# Altium project SVPXGR740_3U.PrjPcb (part 7 of 8)

## Sheet USB_JTAG.SchDoc
size A3
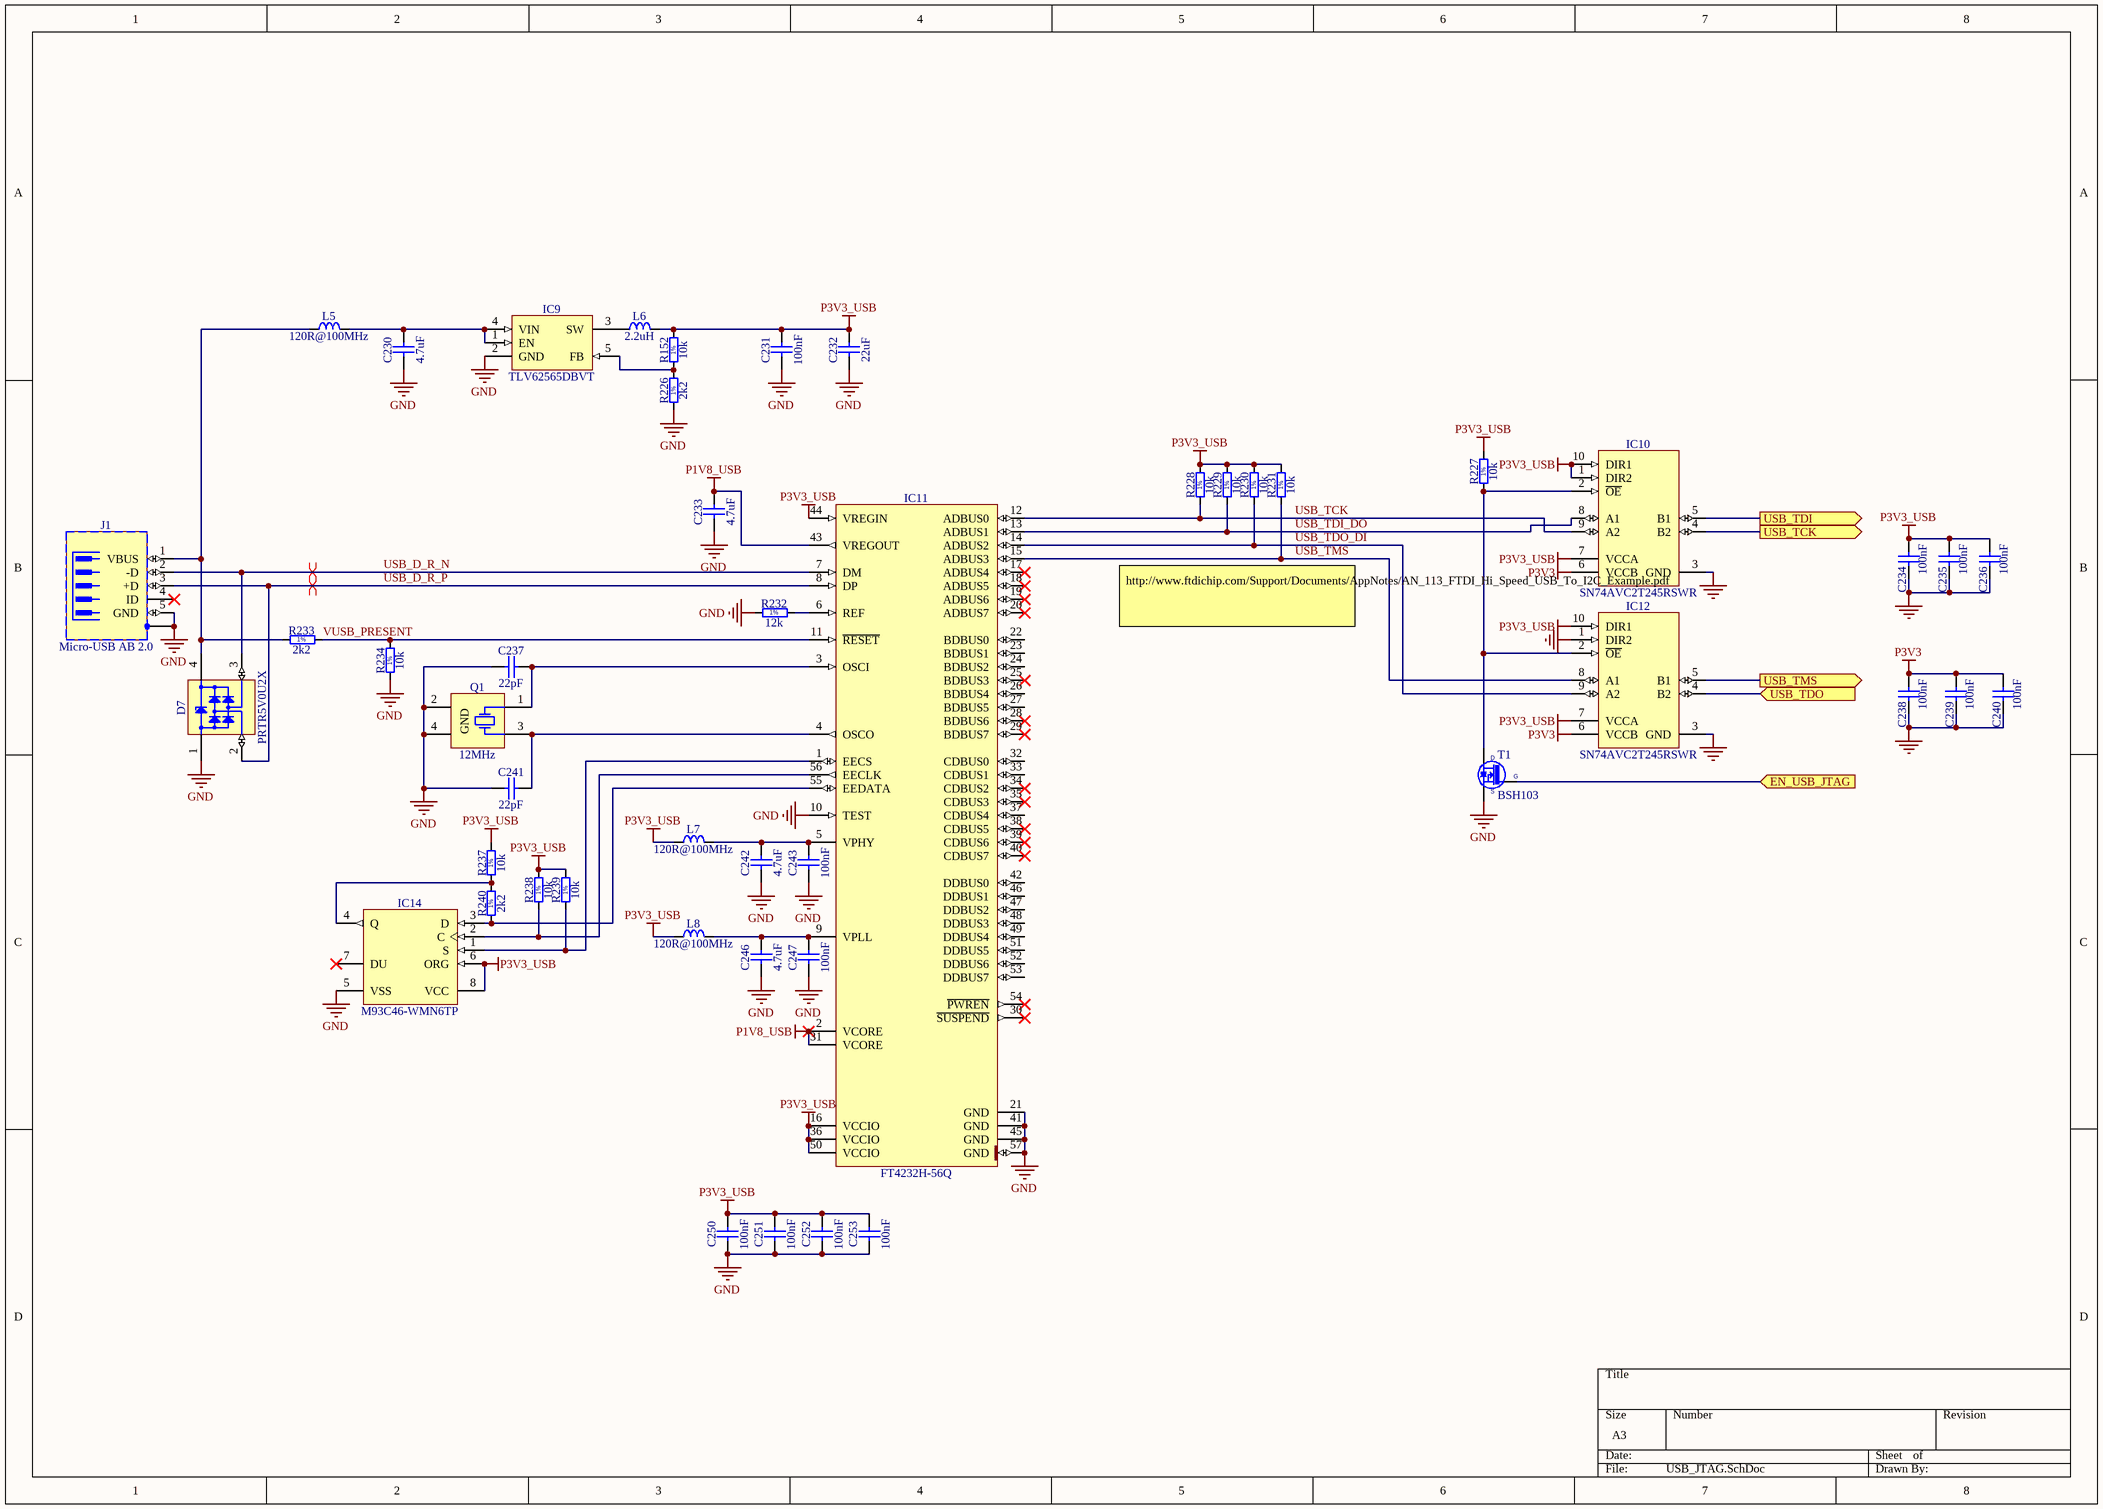
[diagram p21: USB_JTAG.SchDoc]

### Parts
C230  4.7uF  [CAPC2012X135N]
C231  100nF  [CAPC0603X33N]
C232  22uF  [CAPC1709X100N]
C233  4.7uF  [CAPC2012X135N]
C234  100nF  [CAPC0603X33N]
C235  100nF  [CAPC0603X33N]
C236  100nF  [CAPC0603X33N]
C237  22pF  [CAPC1005X55N]
C238  100nF  [CAPC0603X33N]
C239  100nF  [CAPC0603X33N]
C240  100nF  [CAPC0603X33N]
C241  22pF  [CAPC1005X55N]
C242  4.7uF  [CAPC2012X135N]
C243  100nF  [CAPC0603X33N]
C246  4.7uF  [CAPC2012X135N]
C247  100nF  [CAPC0603X33N]
C250  100nF  [CAPC0603X33N]
C251  100nF  [CAPC0603X33N]
C252  100nF  [CAPC0603X33N]
C253  100nF  [CAPC0603X33N]
D7  PRTR5V0U2X  [SOT190P230X110-4N]
IC9  TLV62565DBVT  [SOT95P280X145-5N]
IC10  SN74AVC2T245RSWR  [QFN40P140X180X55-10N]
IC11  FT4232H-56Q  [QFN50P800X800X100-57N-S620]
IC12  SN74AVC2T245RSWR  [QFN40P140X180X55-10N]
IC14  M93C46-WMN6TP  [SOIC127P600X175-8N]
J1  Micro-USB AB 2.0  [HIROSE_ZX62RD-AB-5P8]
L5  120R@100MHz  [INDC1608X65N]
L6  2.2uH  [IND_WURTH_WE-PMCI_0806LR]
L7  120R@100MHz  [INDC1608X65N]
L8  120R@100MHz  [INDC1608X65N]
Q1  12MHz  [XTAL_TXC_7M]
R152  10k  [RESC1005X40N]
R226  2k2  [RESC1005X40N]
R227  10k  [RESC1005X40N]
R228  10k  [RESC1005X40N]
R229  10k  [RESC1005X40N]
R230  10k  [RESC1005X40N]
R231  10k  [RESC1005X40N]
R232  12k  [RESC1005X40N]
R233  2k2  [RESC1005X40N]
R234  10k  [RESC1005X40N]
R237  10k  [RESC1005X40N]
R238  10k  [RESC1005X40N]
R239  10k  [RESC1005X40N]
R240  2k2  [RESC1005X40N]
T1  BSH103  [SOT95P230X110-3N]

### Ports
EN_USB_JTAG (in), USB_TCK (out), USB_TDI (out), USB_TDO (in), USB_TMS (out)

### Nets
GND: C230.1 C231.1 C232.1 C233.1 C234.1 C235.1 C236.1 C237.1 C238.1 C239.1 C240.1 C241.1 C242.1 C243.1 C246.1 C247.1 C250.1 C251.1 C252.1 C253.1 D7.1(GND) IC9.2(GND) IC10.3(GND) IC11.10(TEST) IC11.21(GND) IC11.41(GND) IC11.45(GND) IC11.57(GND) IC12.1(DIR2) IC12.3(GND) IC14.5(VSS) J1.5(GND) J1.6(SH) Q1.2(GND) Q1.4(GND) R226.1 R232.1 R234.1 T1.2(S)
P1V8_USB: C233.2 IC11.2(VCORE) IC11.31(VCORE) IC11.43(VREGOUT)
P3V3: C238.2 C239.2 C240.2 IC10.6(VCCB) IC12.6(VCCB)  [project net 3.3V]
P3V3_USB: C231.2 C232.2 C234.2 C235.2 C236.2 C250.2 C251.2 C252.2 C253.2 IC10.1(DIR2) IC10.7(VCCA) IC10.10(DIR1) IC11.16(VCCIO) IC11.36(VCCIO) IC11.44(VREGIN) IC11.50(VCCIO) IC12.7(VCCA) IC12.10(DIR1) IC14.6(ORG) IC14.8(VCC) L6.2 L7.1 L8.1 R152.2 R227.2 R228.2 R229.2 R230.2 R231.2 R237.2 R238.2 R239.2
CPU_TCK: IC10.4(B2) ; port USB_TCK
CPU_TDI: IC10.5(B1) ; port USB_TDI
CPU_TDO: IC12.4(B2) ; port USB_TDO
CPU_TMS: IC12.5(B1) ; port USB_TMS
GND_DET: T1.1(G) ; port EN_USB_JTAG
USB_D_R_N: D7.3(I/O2) IC11.7(DM) J1.2(-D)
USB_D_R_P: D7.2(I/O1) IC11.8(DP) J1.3(+D)
USB_TCK: IC10.9(A2) IC11.12(ADBUS0) R228.1
USB_TDI_DO: IC10.8(A1) IC11.13(ADBUS1) R229.1
USB_TDO_DI: IC11.14(ADBUS2) IC12.9(A2) R230.1
USB_TMS: IC11.15(ADBUS3) IC12.8(A1) R231.1
VUSB_PRESENT: IC11.11(~{RESET}) R233.2 R234.2
NetC230_2: C230.2 IC9.1(EN) IC9.4(VIN) L5.2
NetC237_2: C237.2 IC11.3(OSCI) Q1.1(X)
NetC241_2: C241.2 IC11.4(OSCO) Q1.3(X)
NetC242_2: C242.2 C243.2 IC11.5(VPHY) L7.2
NetC246_2: C246.2 C247.2 IC11.9(VPLL) L8.2
NetD7_4: D7.4(VCC) J1.1(VBUS) L5.1 R233.1
NetIC9_3: IC9.3(SW) L6.1
NetIC9_5: IC9.5(FB) R152.1 R226.2
NetIC10_2: IC10.2(~{OE}) IC12.2(~{OE}) R227.1 T1.3(D)
NetIC11_1: IC11.1(EECS) IC14.1(S) R239.1
NetIC11_6: IC11.6(REF) R232.2
NetIC11_55: IC11.55(EEDATA) IC14.3(D) R240.2
NetIC11_56: IC11.56(EECLK) IC14.2(C) R238.1
NetIC14_4: IC14.4(Q) R237.1 R240.1

Not connected (* = marked no-connect by the designer): IC11 17(ADBUS4)* 18(ADBUS5)* 19(ADBUS6)* 20(ADBUS7)* 22(BDBUS0) 23(BDBUS1) 24(BDBUS2) 25(BDBUS3)* 26(BDBUS4) 27(BDBUS5) 28(BDBUS6)* 29(BDBUS7)* 30(~{SUSPEND})* 32(CDBUS0) 33(CDBUS1) 34(CDBUS2)* 35(CDBUS3)* 37(CDBUS4) 38(CDBUS5)* 39(CDBUS6)* 40(CDBUS7)* 42(DDBUS0) 46(DDBUS1) 47(DDBUS2) 48(DDBUS3) 49(DDBUS4) 51(DDBUS5) 52(DDBUS6) 53(DDBUS7) 54(~{PWREN})*; IC14 7(DU)*; J1 4(ID)*

### Layout directives
differential pair: USB_D_R_N, USB_D_R_P

### Notes on the sheet
- http://www.ftdichip.com/Support/Documents/AppNotes/AN_113_FTDI_Hi_Speed_USB_To_I2C_Example.pdf
- (in symbol R0402_2K2_1%_0.0625W_100PPM) 1%
- (in symbol R0402_10K_1%_0.0625W_100PPM) 1%
- (in symbol R0402_12K_1%_0.0625W_100PPM) 1%

### Library data of the parts
C230 C233 C242 C246 = CC0805_4.7UF_10V_10%_X5R: Non-polarised capacitor; Part Description: SMD Multilayer Chip Ceramic Capacitor; Manufacturer: GENERIC; Manufacturer1 Part Number: 222224013672; Voltage: 10V; TC: X5R; Tolerance: ±10%; Part Number: CC0805_4.7UF_10V_10%_X5R; Component Kind: Standard; Component Type: Standard; Pin Count: 2; Value: 4.7uF; Status: Preferred; Manufacturer Part Number: CC0805_4.7UF_10V_10%_X5R; Case: 0805; Mounted: Yes; Socket: No; SMD: Yes; Sense: No; Manufacturer1 Example: PHYCOMP; Manufacturer1 ComponentHeight: 1.45mm; HelpURL: \\cern.ch\dfs\Applications\Altium\Datasheets\CC0805_X5R_PHYCOMP_HC.pdf; Author: CERN DEM JLC; CreateDate: 03.12.2007; LatestRevisionDate: 03.12.2007
C231 C234-C236 C238-C240 C243 C247 C250-C253 = CC0201_100NF_6.3V_10%_X5R: Non-polarised capacitor; Part Description: SMD Multilayer Chip Ceramic Capacitor; Manufacturer: GENERIC; Manufacturer1 Part Number: 02016D104KAT2A; Voltage: 6.3V; TC: X5R; Tolerance: ±10%; Part Number: CC0201_100NF_6.3V_10%_X5R; Component Kind: Standard; Component Type: Standard; Pin Count: 2; Value: 100nF; Status: Not Recommended; Manufacturer Part Number: CC0201_100NF_6.3V_10%_X5R; Case: 0201; Mounted: Yes; Socket: No; SMD: Yes; Sense: No; Manufacturer1 Example: AVX; Manufacturer1 ComponentHeight: 0.33mm; HelpURL: \\cern.ch\dfs\Applications\Altium\Datasheets\CC0201_X5R_AVX.pdf; Author: CERN DEM JLC
  C231 C243 C247 C250-C253: CreateDate: 03.12.2007; LatestRevisionDate: 03.12.2007
  C234-C236 C238-C240: CreateDate: 2007-12-03; LatestRevisionDate: 2007-12-03
C232 = CC0603_22UF_6.3V_20%_X5R: Non-polarised capacitor; Part Description: SMD Multilayer Chip Ceramic Capacitor; Manufacturer: GENERIC; Manufacturer1 Part Number: C1608X5R0J226M080AC; Voltage: 6.3V; TC: X5R; Tolerance: ±20%; Part Number: CC0603_22UF_6.3V_20%_X5R; Component Kind: Standard; Component Type: Standard; Pin Count: 2; Value: 22uF; Status: None; Manufacturer Part Number: CC0603_22UF_6.3V_20%_X5R; Case: 0603; Mounted: Yes; Socket: No; SMD: Yes; Sense: No; Manufacturer1 Example: TDK; Manufacturer1 ComponentHeight: 1mm; HelpURL: \\cern.ch\dfs\Applications\Altium\Datasheets\CC0603_X5R_TDK_C.pdf; Author: CERN DEM JLC; CreateDate: 16.12.2013; LatestRevisionDate: 13.09.2016; ClassName: Artix
C237 C241 = CC0402_22PF_50V_5%_C0G: Non-polarised capacitor; Part Description: SMD Multilayer Chip Ceramic Capacitor; Manufacturer: GENERIC; Manufacturer1 Part Number: C0402C220J5GACTU; Voltage: 50V; TC: C0G/NP0; Tolerance: ±5%; Part Number: CC0402_22PF_50V_5%_C0G; Component Kind: Standard; Component Type: Standard; Pin Count: 2; Value: 22pF; Status: Preferred; Manufacturer Part Number: CC0402_22PF_50V_5%_C0G; Case: 0402; Mounted: Yes; Socket: No; SMD: Yes; Sense: No; Manufacturer1 Example: KEMET; Manufacturer1 ComponentHeight: 0.55mm; HelpURL: \\cern.ch\dfs\Applications\Altium\Datasheets\CC0805_C0G_KEMET_(Commercial Grade).pdf; Author: CERN DEM JLC; CreateDate: 03.12.2007; LatestRevisionDate: 03.12.2007
D7 = PRTR5V0U2X: Ultra Low Capacitance Double Rail-to-Rail ESD Protection Diode; Part Description: Ultra Low Capacitance (1pF) Double Rail-to-Rail ESD Protection Diode (8kV); Manufacturer: NXP SEMICONDUCTORS; Voltage: 5.5V; PressFit: No; Bonding: No; Part Number: PRTR5V0U2X; Component Kind: Standard; Component Type: Standard; Device: PRTR5V0U2X; PackageDescription: SOT143B, SOT, 1.90mm Pitch; 4 Pin, 1.30mm W X 2.90mm L X 1.10mm H body, IPC Medium Density; Manufacturer Part Number: PRTR5V0U2X; Pin Count: 4; Case: SOT143B; Mounted: Yes; Socket: No; SMD: Yes; Sense: No; ComponentHeight: 1.1mm; HelpURL: \\cern.ch\dfs\Applications\Altium\Datasheets\PRTR5V0U2X.pdf; Author: CERN DEM JLC; CreateDate: 22.03.2011; LatestRevisionDate: 22.03.2011
IC9 = TLV62565DBVT: 1.5A High Efficiency Step-Down Converter, Adjustable Output Voltage; Manufacturer: TEXAS INSTRUMENTS; PressFit: No; Bonding: No; Part Number: TLV62565DBVT; Component Kind: Standard; Component Type: Standard; Device: TLV62565DBVT; PackageDescription: SOT, 0.95mm Pitch; 5 Pin, 1.60mm W X 2.90mm L X 1.45mm H Body, IPC Medium Density; Part Description: 1.5A High Efficiency Step-Down Converter, Adjustable Output Voltage; Manufacturer Part Number: TLV62565DBVT; Pin Count: 5; Case: SOT23-5; Mounted: Yes; Socket: No; SMD: Yes; Sense: No; ComponentHeight: 1.45mm; HelpURL: \\cern.ch\dfs\Applications\Altium\Datasheets\TLV62565DBVT.pdf; Author: CERN DEM JMW; CreateDate: 29.08.2016; LatestRevisionDate: 29.08.2016
IC10 IC12 = SN74AVC2T245RSWR: Dual-Bit Dual-Supply Bus Transceiver With Configurable Voltage Translation and 3-State Outputs; Manufacturer: TEXAS INSTRUMENTS; PressFit: No; Bonding: No; Part Number: SN74AVC2T245RSWR; Component Kind: Standard; Component Type: Standard; Device: SN74AVC2T245RSWR; PackageDescription: QFN, 0.40mm Pitch, Rect.;10 Pin, 1.80mm L X 1.40mm W X 0.55mm H Body, IPC Medium Density; Status: Not Recommended; Part Description: Dual-Bit Dual-Supply Bus Transceiver With Configurable Voltage Translation and 3-State Outputs; Manufacturer Part Number: SN74AVC2T245RSWR; Pin Count: 10; Case: QFN10; Mounted: Yes; Socket: No; SMD: Yes; Sense: No; ComponentHeight: 0.55mm; Author: CERN DEM JLC; HelpURL: \\cern.ch\dfs\Applications\Altium\Datasheets\SN74AVC2T245RSWR.pdf; CreateDate: 07.07.2014; LatestRevisionDate: 30.03.2017
IC11 = FT4232H-56Q: Quad High Speed USB to Multipurpose UART/MPSSE IC; Manufacturer: FUTURE TECHNOLOGY DEVICES INTERNATIONAL (FTDI); PressFit: No; Bonding: No; Part Number: FT4232H-56Q; Component Kind: Standard; Component Type: Standard; Device: FT4232H-56Q; PackageDescription: QFN, 0.50mm Pitch, Square; 56 Pin, 8.00mm L X 8.00mm W X 1.00mm H body (6.1mm X 6.1mm Thermal tab), IPC Medium Density; Part Description: Quad High Speed USB to Multipurpose UART/MPSSE IC; Manufacturer Part Number: FT4232H-56Q; Pin Count: 57; Case: QFN56; Mounted: Yes; Socket: No; SMD: Yes; Sense: No; ComponentHeight: 1mm; Author: CERN DEM JLC; HelpURL: \\cern.ch\dfs\Applications\Altium\Datasheets\FT4232H-56Q.pdf; CreateDate: 11.10.2016; LatestRevisionDate: 11.10.2016
IC14 = M93C46-WMN6TP: 2.5 to 5.5 V, 1Kb (128x8) Serial Microwire Bus EEPROM; Part Description: 1Kbit (128 x 8 bit or 64 x 16 bit) MICROWIRE® Serial Access EEPROM; Manufacturer: ST MICROELECTRONICS; PressFit: No; Bonding: No; Part Number: M93C46-WMN6TP; Component Kind: Standard; Component Type: Standard; Device: M93C46-WMN6TP; PackageDescription: SOIC 8, Pitch 1.27mm - Body 4x5mm, IPC Medium Density; Manufacturer Part Number: M93C46-WMN6TP; Pin Count: 8; Case: SOIC8; Mounted: Yes; Socket: No; SMD: Yes; Sense: No; ComponentHeight: 1.75mm; HelpURL: \\cern.ch\dfs\Applications\Altium\Datasheets\M93C46-WMN6TP.pdf; Author: CERN DEM JLC; CreateDate: 15.11.2012; LatestRevisionDate: 15.11.2012
J1 = HIROSE_ZX62RD-AB-5P8: 5 Pin + 1 Shield USB Receptacle; Part Description: Micro-USB 2.0 Right Angle, SMD Type AB - Reverse (Top mount), Shell Through Hole; Manufacturer: HIROSE (HRS); PressFit: No; Part Number: HIROSE_ZX62RD-AB-5P8; Component Kind: Standard; Component Type: Standard; Pin Count: 7; Family: Micro-USB AB 2.0; Mounted: Yes; Socket: No; SMD: Yes; Sense: No; Status: None; Manufacturer Part Number: ZX62RD-AB-5P8; ComponentHeight: 2.35mm; HelpURL: \\cern.ch\dfs\Applications\Altium\Datasheets\HIROSE_ZX62RD-AB-5P8.pdf; ComponentLink1URL: \\cern.ch\dfs\Applications\Altium\Datasheets\HIROSE_ZX62RD-AB-5P8_Package-Drawing.pdf; ComponentLink1Description: Package-Drawing; Author: CERN DEM JLC; CreateDate: 29.10.2014; LatestRevisionDate: 29.10.2014; ClassName: Connectors
L5 L7 L8 = IND0603_MURATA_BLM18SG121TN1D: Inductor; Part Description: SMD EMIFIL Suppression Chip Ferrite Bead; Manufacturer: MURATA; Power: 3A; Resistance: 0.025R; Tolerance: ±25%; Part Number: IND0603_MURATA_BLM18SG121TN1D; Component Kind: Standard; Component Type: Standard; Pin Count: 2; Value: 120R@100MHz; Status: None; Manufacturer Part Number: BLM18SG121TN1D; Case: 0603; Mounted: Yes; Socket: No; SMD: Yes; Sense: No; ComponentHeight: 0.65mm; HelpURL: \\cern.ch\dfs\Applications\Altium\Datasheets\IND0603_MURATA_BLM18S.pdf; Author: CERN DEM JLC; CreateDate: 23.07.2014; LatestRevisionDate: 23.07.2014
L6 = IND_2.2UH_20%_WURTH_WE-PMCI_74479276222C: Inductor; Part Description: SMD Power Molded Chip  Inductor (WE-PMCI Series); Manufacturer: WURTH ELEKTRONIK; Power: 1.1A; Resistance: 0.112R; Tolerance: ±20%; Part Number: IND_2.2UH_20%_WURTH_WE-PMCI_74479276222C; Component Kind: Standard; Component Type: Standard; Pin Count: 2; Value: 2.2uH; Status: None; Manufacturer Part Number: 74479276222C; Case: 0806; Mounted: Yes; Socket: No; SMD: Yes; Sense: No; ComponentHeight: 1mm; HelpURL: \\cern.ch\dfs\Applications\Altium\Datasheets\IND_WURTH_WE-PMCI_74479276222C.pdf; Author: CERN DEM JLC; CreateDate: 20.10.2016; LatestRevisionDate: 20.10.2016
Q1 = XTAL_12MHZ_TXC_7M-12.000MAAJ-T: Crystal 4 pins 1=XTAL Control 2=GND3=XTAL 4=GND; Part Description: ±30ppm 18pF -20°C to +70°C  4 Pins, 3.2x2.5X0.8mm, SMD Sealing Crystal, 7M Series; Manufacturer: TXC CORPORATION; PressFit: No; Bonding: No; Part Number: XTAL_12MHZ_TXC_7M-12.000MAAJ-T; Component Kind: Standard; Component Type: Standard; PackageDescription: 4 Pins, 2.5x3.2mm, SMD Sealing Crystal, 7M Serie; Value: 12MHz; Manufacturer Part Number: 7M-12.000MAAJ-T; Pin Count: 4; Mounted: Yes; Socket: No; SMD: Yes; Sense: No; ComponentHeight: 0.8mm; HelpURL: \\cern.ch\dfs\Applications\Altium\Datasheets\XTAL_TXC_7M.pdf; Author: CERN DEM JLC; CreateDate: 19.06.2012; LatestRevisionDate: 19.06.2012
R152 R227-R231 R234 R237-R239 = R0402_10K_1%_0.0625W_100PPM: as R177 on sheet Power; Part Number: R0402_10K_1%_0.0625W_100PPM; Component Kind: Standard; Component Type: Standard; Pin Count: 2; Value: 10k; Status: Not Recommended; Power: 0.0625W; Tolerance: ±1%; Manufacturer Part Number: R0402_10K_1%_0.0625W_100PPM; Case: 0402; Mounted: Yes; Sense: No; Socket: No; SMD: Yes; Manufacturer1 Example: YAGEO PHYCOMP; Manufacturer1 ComponentHeight: 0.4mm; HelpURL: \\cern.ch\dfs\Applications\Altium\Datasheets\R0402_Phycomp_RC0402.pdf; Author: CERN DEM JLC; CreateDate: 03.12.2007; LatestRevisionDate: 17.10.2012
R226 R233 R240 = R0402_2K2_1%_0.0625W_100PPM: Resistor - 1%; Part Description: General Purpose Thick Film Chip Resistor; Manufacturer: GENERIC; Manufacturer1 Part Number: 232270672202L; TC: ±100ppm/°C; PressFit: No; Part Number: R0402_2K2_1%_0.0625W_100PPM; Component Kind: Standard; Component Type: Standard; Pin Count: 2; Value: 2k2; Status: Not Recommended; Power: 0.0625W; Tolerance: ±1%; Manufacturer Part Number: R0402_2K2_1%_0.0625W_100PPM; Case: 0402; Mounted: Yes; Sense: No; Socket: No; SMD: Yes; Manufacturer1 Example: YAGEO PHYCOMP; Manufacturer1 ComponentHeight: 0.4mm; HelpURL: \\cern.ch\dfs\Applications\Altium\Datasheets\R0402_Phycomp_RC0402.pdf; Author: CERN DEM JLC; CreateDate: 03.12.2007; LatestRevisionDate: 17.10.2012
R232 = R0402_12K_1%_0.0625W_100PPM: Resistor - 1%; Part Description: General Purpose Thick Film Chip Resistor; Manufacturer: GENERIC; Manufacturer1 Part Number: 232270671203L; TC: ±100ppm/°C; PressFit: No; Part Number: R0402_12K_1%_0.0625W_100PPM; Component Kind: Standard; Component Type: Standard; Pin Count: 2; Value: 12k; Status: Not Recommended; Power: 0.0625W; Tolerance: ±1%; Manufacturer Part Number: R0402_12K_1%_0.0625W_100PPM; Case: 0402; Mounted: Yes; Sense: No; Socket: No; SMD: Yes; Manufacturer1 Example: YAGEO PHYCOMP; Manufacturer1 ComponentHeight: 0.4mm; HelpURL: \\cern.ch\dfs\Applications\Altium\Datasheets\R0402_Phycomp_RC0402.pdf; Author: CERN DEM JLC; CreateDate: 03.12.2007; LatestRevisionDate: 17.10.2012
T1 = BSH103: N-CHANNEL MOSFET WITH DIODE; Part Description: 30V 850mA N-Channel Enhancement Mode Field-Effect Transistor; Manufacturer: NEXPERIA; PressFit: No; Bonding: No; Part Number: BSH103; Component Kind: Standard; Component Type: Standard; Device: BSH103; PackageDescription: SOT23, 3 pin, Pitch 0.95mm - 1.3mm W X 2.9mm L X 1.1mm H, IPC Medium Density; Manufacturer Part Number: BSH103; Pin Count: 3; Case: SOT23-3; Mounted: Yes; Socket: No; SMD: Yes; Sense: No; ComponentHeight: 1.1mm; HelpURL: \\cern.ch\dfs\Applications\Altium\Datasheets\BSH103.pdf; Author: CERN DEM JLC; CreateDate: 16.03.2010; LatestRevisionDate: 20.06.2017

## Sheet Management.SchDoc: SVPXFMC Carrier 3U
size A4; CheckedBy: \; Author: G.Kasprowicz; CompanyName: ISE; DrawnBy: T.Przywozki; Organization: WUT ISE; Address1: Warsaw University of Technology; Address2: Nowowiejska 15/19 00-665 Warsaw; Revision: 1.0.; SheetNumber: 16; SheetTotal: 20; Project: SVPXFMC Carrier 3U; ModifiedBy: -; CheckedDate: -; Title2: MSP430 management MCU; DivGrp: ISE; Designer: G. Kasprowicz
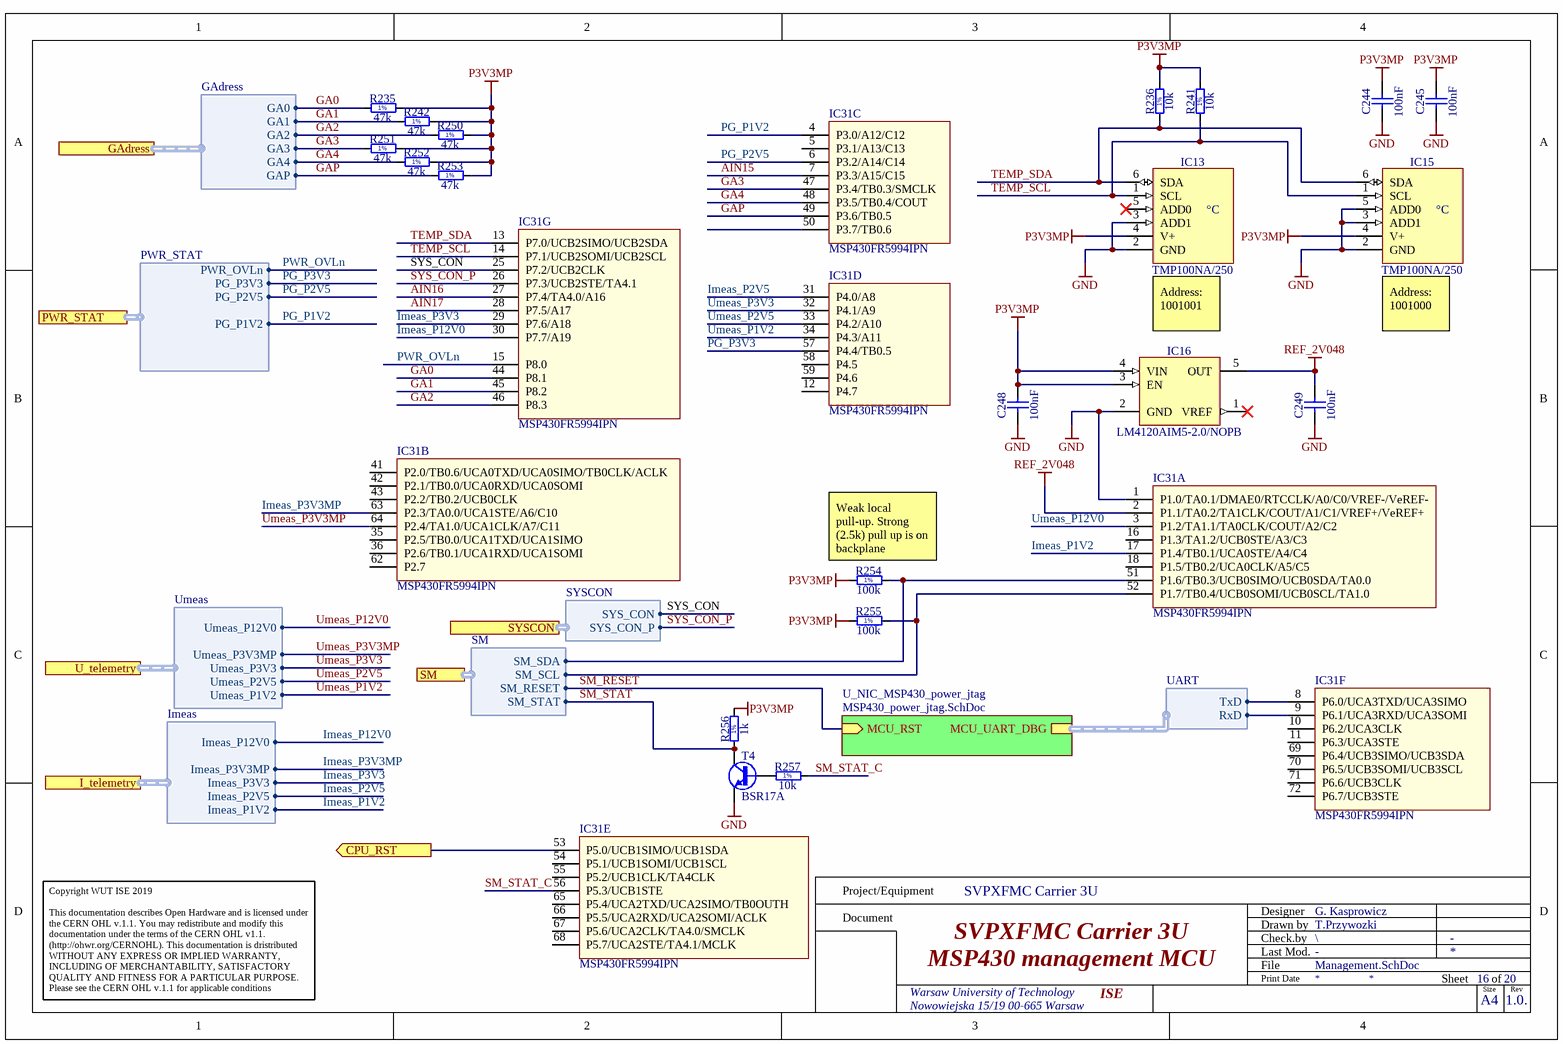
[diagram p22: Management.SchDoc]

### Parts
C244  100nF  [CAPC1005X55N]
C245  100nF  [CAPC1005X55N]
C248  100nF  [CAPC1005X55N]
C249  100nF  [CAPC1005X55N]
IC13  TMP100NA/250  [SOT95P280X145-6N]
IC15  TMP100NA/250  [SOT95P280X145-6N]
IC16  LM4120AIM5-2.0/NOPB  [SOT95P280X145-5N]
IC31  MSP430FR5994IPN  [PQFP50P1400X1400-80N]  (parts A,B,C,D,E,F,G of 9)
R235  47k  [RESC1005X40N]
R236  10k  [RESC1005X40N]
R241  10k  [RESC1005X40N]
R242  47k  [RESC1005X40N]
R250  47k  [RESC1005X40N]
R251  47k  [RESC1005X40N]
R252  47k  [RESC1005X40N]
R253  47k  [RESC1005X40N]
R254  100k  [RESC1005X40N]
R255  100k  [RESC1005X40N]
R256  1k  [RESC1005X40N]
R257  10k  [RESC1005X40N]
T4  BSR17A  [SOT95P240X110-3N]

### Sub-sheets
U_NIC_MSP430_power_jtag = MSP430_power_jtag.SchDoc: MCU_UART_DBG (harness UART), MCU_RST (in)

### Ports
CPU_RST (out), GAdress (harness GAdress), I_telemetry (harness Imeas), PWR_STAT (harness PWR_STAT), SM (harness SM), SYSCON (harness SYSCON), U_telemetry (harness Umeas)

### Harnesses
UART: TxD, RxD
SM: SM_SCL, SM_SDA, SM_RESET, SM_STAT
GAdress: GA0, GA1, GA2, GA3, GA4, GAP
PWR_STAT: PG_P1V2, PG_P2V5, PG_P3V3, PWR_OVLn
SYSCON: SYS_CON, SYS_CON_P
Imeas: Imeas_P12V0, Imeas_P3V3, Imeas_P2V5, Imeas_P1V2, Imeas_P3V3MP
Umeas: Umeas_P12V0, Umeas_P3V3, Umeas_P2V5, Umeas_P1V2, Umeas_P3V3MP

### Nets
GND: C244.1 C245.1 C248.1 C249.1 IC13.2(GND) IC13.3(ADD1) IC15.2(GND) IC15.3(ADD1) IC15.5(ADD0) IC16.2(GND) IC31.1(P1.0/TA0.1/DMAE0/RTCCLK/A0/C0/VREF-/VeREF-) T4.2(E)
P3V3MP: C244.2 C245.2 C248.2 IC13.4(V+) IC15.4(V+) IC16.3(EN) IC16.4(VIN) R235.2 R236.2 R241.2 R242.2 R250.2 R251.2 R252.2 R253.2 R254.1 R255.1 R256.2
REF_2V048: C249.2 IC16.5(OUT) IC31.2(P1.1/TA0.2/TA1CLK/COUT/A1/C1/VREF+/VeREF+)
AIN15: IC31.7(P3.3/A15/C15)  [project net AIN15_16]
AIN16: IC31.27(P7.4/TA4.0/A16)  [project net AIN16_16]
AIN17: IC31.28(P7.5/A17)  [project net AIN17_16]
CPU_RST: IC31.53(P5.0/UCB1SIMO/UCB1SDA) ; port CPU_RST
GA0: IC31.44(P8.1) R235.1 ; port GAdress.GA0
GA1: IC31.45(P8.2) R242.1 ; port GAdress.GA1
GA2: IC31.46(P8.3) R250.1 ; port GAdress.GA2
GA3: IC31.47(P3.4/TB0.3/SMCLK) R251.1 ; port GAdress.GA3
GA4: IC31.48(P3.5/TB0.4/COUT) R252.1 ; port GAdress.GA4
GAP: IC31.49(P3.6/TB0.5) R253.1 ; port GAdress.GAP
Imeas_P1V2: IC31.17(P1.4/TB0.1/UCA0STE/A4/C4) ; port I_telemetry.Imeas_P1V2
Imeas_P2V5: IC31.31(P4.0/A8) ; port I_telemetry.Imeas_P2V5
Imeas_P3V3: IC31.29(P7.6/A18) ; port I_telemetry.Imeas_P3V3
Imeas_P3V3MP: IC31.63(P2.3/TA0.0/UCA1STE/A6/C10) ; port I_telemetry.Imeas_P3V3MP
Imeas_P12V0: IC31.30(P7.7/A19) ; port I_telemetry.Imeas_P12V0
PG_P1V2: IC31.4(P3.0/A12/C12) ; port PWR_STAT.PG_P1V2
PG_P2V5: IC31.6(P3.2/A14/C14) ; port PWR_STAT.PG_P2V5
PG_P3V3: IC31.57(P4.4/TB0.5) ; port PWR_STAT.PG_P3V3
PWR_OVLn: IC31.15(P8.0) ; port PWR_STAT.PWR_OVLn
RxD: IC31.9(P6.1/UCA3RXD/UCA3SOMI) ; sheet U_NIC_MSP430_power_jtag/MCU_UART_DBG.RxD
SM0: IC31.52(P1.7/TB0.4/UCB0SOMI/UCB0SCL/TA1.0) R255.2 ; port SM.SM_SCL
SM1: IC31.51(P1.6/TB0.3/UCB0SIMO/UCB0SDA/TA0.0) R254.2 ; port SM.SM_SDA
SM_RESET: sheet U_NIC_MSP430_power_jtag/MCU_RST, port SM.SM_RESET  [project net SM2]
SM_STAT: R256.1 T4.3(C) ; port SM.SM_STAT  [project net SM3]
SM_STAT_C: IC31.56(P5.3/UCB1STE) R257.2  [project net SM_STAT_C_16]
SYS_CON: IC31.25(P7.2/UCB2CLK) ; port SYSCON.SYS_CON
SYS_CON_P: IC31.26(P7.3/UCB2STE/TA4.1) ; port SYSCON.SYS_CON_P
TEMP_SCL: IC13.1(SCL) IC15.1(SCL) IC31.14(P7.1/UCB2SOMI/UCB2SCL) R241.1  [project net TEMP_SCL_16]
TEMP_SDA: IC13.6(SDA) IC15.6(SDA) IC31.13(P7.0/UCB2SIMO/UCB2SDA) R236.1  [project net TEMP_SDA_16]
TxD: IC31.8(P6.0/UCA3TXD/UCA3SIMO) ; sheet U_NIC_MSP430_power_jtag/MCU_UART_DBG.TxD
Umeas_P1V2: IC31.34(P4.3/A11) ; port U_telemetry.Umeas_P1V2
Umeas_P2V5: IC31.33(P4.2/A10) ; port U_telemetry.Umeas_P2V5
Umeas_P3V3: IC31.32(P4.1/A9) ; port U_telemetry.Umeas_P3V3
Umeas_P3V3MP: IC31.64(P2.4/TA1.0/UCA1CLK/A7/C11) ; port U_telemetry.Umeas_P3V3MP
Umeas_P12V0: IC31.3(P1.2/TA1.1/TA0CLK/COUT/A2/C2) ; port U_telemetry.Umeas_P12V0
NetR257_1: R257.1 T4.1(B)

Not connected (* = marked no-connect by the designer): IC13 5(ADD0)*; IC16 1(VREF)*; IC31 5(P3.1/A13/C13) 10(P6.2/UCA3CLK) 11(P6.3/UCA3STE) 12(P4.7) 16(P1.3/TA1.2/UCB0STE/A3/C3) 18(P1.5/TB0.2/UCA0CLK/A5/C5) 35(P2.5/TB0.0/UCA1TXD/UCA1SIMO) 36(P2.6/TB0.1/UCA1RXD/UCA1SOMI) 41(P2.0/TB0.6/UCA0TXD/UCA0SIMO/TB0CLK/ACLK) 42(P2.1/TB0.0/UCA0RXD/UCA0SOMI) 43(P2.2/TB0.2/UCB0CLK) 50(P3.7/TB0.6) 54(P5.1/UCB1SOMI/UCB1SCL) 55(P5.2/UCB1CLK/TA4CLK) 58(P4.5) 59(P4.6) 62(P2.7) 65(P5.4/UCA2TXD/UCA2SIMO/TB0OUTH) 66(P5.5/UCA2RXD/UCA2SOMI/ACLK) 67(P5.6/UCA2CLK/TA4.0/SMCLK) 68(P5.7/UCA2STE/TA4.1/MCLK) 69(P6.4/UCB3SIMO/UCB3SDA) 70(P6.5/UCB3SOMI/UCB3SCL) 71(P6.6/UCB3CLK) 72(P6.7/UCB3STE)

### Notes on the sheet
- Address: 1001001
- (near IC15) Address: 1001000
- (near R254) Weak local pull-up. Strong (2.5k) pull up is on backplane
- Project/Equipment
- Document
- Designer
- Drawn by
- Check.by
- Copyright WUT ISE 2019
  This documentation describes Open Hardware and is licensed under the CERN OHL v.1.1. You may redistribute and modify this documentation under the terms of the CERN OHL v1.1.
  (http://ohwr.org/CERNOHL). This documentation is dristributed WITHOUT ANY EXPRESS OR IMPLIED WARRANTY, INCLUDING OF MERCHANTABILITY, SATISFACTORY QUALITY AND FITNESS FOR A PARTICULAR PURPOSE. Please see the CERN OHL v.1.1 for applicable conditions
- File
- Last Mod.
- Print Date
- Sheet
- Size
- A4
- of
- Rev
- (in symbol R0402_1K_1%_0.0625W_100PPM) 1%
- (in symbol R0402_10K_1%_0.0625W_100PPM) 1%
- (in symbol R0402_47K_1%_0.0625W_100PPM) 1%
- (in symbol R0402_100K_1%_0.0625W_100PPM) 1%
- (in symbol TMP100NA/250) °C

### Library data of the parts
C244 C245 C248 C249 = CC0402_100NF_25V_10%_X7R_YUDEN_TMK105B7104KVHF: as C270 on sheet Power; Part Number: CC0402_100NF_25V_10%_X7R_YUDEN_TMK105B7104KVHF; Component Kind: Standard; Component Type: Standard; Pin Count: 2; Value: 100nF; Status: Not Recommended; Manufacturer Part Number: TMK105B7104KVHF; Case: 0402; Mounted: Yes; Socket: No; SMD: Yes; Sense: No; HelpURL: \\cern.ch\dfs\Applications\Altium\Datasheets\CC0402_TAIYO-YUDEN_TMK105B7104KVHF.pdf; Author: CERN DEM JLC; ComponentHeight: 0.55mm
  C244 C245: CreateDate: 10/05/2017; LatestRevisionDate: 10/05/2017
  C248 C249: CreateDate: 10.05.2017; LatestRevisionDate: 10.05.2017
IC13 IC15 = TMP100NA/250: Digital Temperature Sensor with I2C Interface; Part Description: -55°C to +125°C, ±3.0°C Accuracy, Digital Temperature Sensor with I2C Interface; Manufacturer: TEXAS INSTRUMENTS; PressFit: No; Bonding: No; Part Number: TMP100NA/250; Component Kind: Standard; Component Type: Standard; Device: TMP100NA/250; PackageDescription: SOT23, 6-Leads, Body 1.6x3.0mm, Pitch 0.95mm, IPC Medium Density; Manufacturer Part Number: TMP100NA/250; Pin Count: 6; Case: SOT23-6; Mounted: Yes; Socket: No; SMD: Yes; Sense: No; ComponentHeight: 1.45mm; HelpURL: \\cern.ch\dfs\Applications\Altium\Datasheets\TMP100NA-250.pdf; Author: CERN DEM JLC; CreateDate: 29.10.2012; LatestRevisionDate: 29.10.2012
IC16 = LM4120AIM5-2.0/NOPB: Precision Micropower Low Dropout Voltage Reference; Part Description: 2.048V Precision Micropower Low Dropout Voltage Reference; Manufacturer: TEXAS INSTRUMENTS; PressFit: No; Bonding: No; Part Number: LM4120AIM5-2.0/NOPB; Component Kind: Standard; Component Type: Standard; Device: LM4120AIM5-2.0/NOPB; PackageDescription: SOT, 0.95mm Pitch; 5 Pin, 1.60mm W X 2.90mm L X 1.45mm H Body, IPC Medium Density; Manufacturer Part Number: LM4120AIM5-2.0/NOPB; Pin Count: 5; Case: SOT23-5; Mounted: Yes; Socket: No; SMD: Yes; Sense: No; ComponentHeight: 1.45mm; HelpURL: \\cern.ch\dfs\Applications\Altium\Datasheets\LM4120AIM5-2.0-NOPB.pdf; Author: CERN DEM JMW; CreateDate: 2016-08-31; LatestRevisionDate: 2016-08-31
IC31 = MSP430FR5994IPN: Manufacturer: TI; Part Description: FRAM microcontroller; Bonding: No; ComponentHeigth: 2mm; PressFit: No; Case: LQFP80; Component Kind: Standard; Component Type: Standard; CreateDate: 2018-01-01; Device: MSP430FR5994IPN; Footprint: LQFP80; HelpURL: *; LatestRevisionDate: 2018-01-01; Manufacturer Part Number: MSP430FR5994IPN; Mounted: Yes; PackageDescription: LQFP80; Part Number: MSP430FR5994IPN; Pin Count: 80; Sense: No; SMD: Yes; Socket: No; Value: *
R235 R242 R250-R253 = R0402_47K_1%_0.0625W_100PPM: as R9-R29 on sheet Flash; Part Number: R0402_47K_1%_0.0625W_100PPM; Component Kind: Standard; Component Type: Standard; Pin Count: 2; Value: 47k; Status: Not Recommended; Power: 0.0625W; Tolerance: ±1%; Manufacturer Part Number: R0402_47K_1%_0.0625W_100PPM; Case: 0402; Mounted: Yes; Sense: No; Socket: No; SMD: Yes; Manufacturer1 Example: YAGEO PHYCOMP; Manufacturer1 ComponentHeight: 0.4mm; HelpURL: \\cern.ch\dfs\Applications\Altium\Datasheets\R0402_Phycomp_RC0402.pdf; Author: CERN DEM JLC; CreateDate: 03.12.2007; LatestRevisionDate: 17.10.2012
R236 R241 R257 = R0402_10K_1%_0.0625W_100PPM: as R177 on sheet Power; Part Number: R0402_10K_1%_0.0625W_100PPM; Component Kind: Standard; Component Type: Standard; Pin Count: 2; Value: 10k; Status: Not Recommended; Power: 0.0625W; Tolerance: ±1%; Manufacturer Part Number: R0402_10K_1%_0.0625W_100PPM; Case: 0402; Mounted: Yes; Sense: No; Socket: No; SMD: Yes; Manufacturer1 Example: YAGEO PHYCOMP; Manufacturer1 ComponentHeight: 0.4mm; HelpURL: \\cern.ch\dfs\Applications\Altium\Datasheets\R0402_Phycomp_RC0402.pdf; Author: CERN DEM JLC
  R236 R241: CreateDate: 03.12.2007; LatestRevisionDate: 17.10.2012
  R257: CreateDate: 03/12/2007; LatestRevisionDate: 17/10/2012
R254 R255 = R0402_100K_1%_0.0625W_100PPM: as R243 on sheet Power; Part Number: R0402_100K_1%_0.0625W_100PPM; Component Kind: Standard; Component Type: Standard; Pin Count: 2; Value: 100k; Status: Not Recommended; Power: 0.0625W; Tolerance: ±1%; Manufacturer Part Number: R0402_100K_1%_0.0625W_100PPM; Case: 0402; Mounted: Yes; Sense: No; Socket: No; SMD: Yes; Manufacturer1 Example: YAGEO PHYCOMP; Manufacturer1 ComponentHeight: 0.4mm; HelpURL: \\cern.ch\dfs\Applications\Altium\Datasheets\R0402_Phycomp_RC0402.pdf; Author: CERN DEM JLC; CreateDate: 03.12.2007; LatestRevisionDate: 17.10.2012
R256 = R0402_1K_1%_0.0625W_100PPM: Resistor - 1%; Part Description: General Purpose Thick Film Chip Resistor; Manufacturer: GENERIC; Manufacturer1 Part Number: 232270671002L; TC: ±100ppm/°C; PressFit: No; Part Number: R0402_1K_1%_0.0625W_100PPM; Component Kind: Standard; Component Type: Standard; Pin Count: 2; Value: 1k; Status: Not Recommended; Power: 0.0625W; Tolerance: ±1%; Manufacturer Part Number: R0402_1K_1%_0.0625W_100PPM; Case: 0402; Mounted: Yes; Sense: No; Socket: No; SMD: Yes; Manufacturer1 Example: YAGEO PHYCOMP; Manufacturer1 ComponentHeight: 0.4mm; HelpURL: \\cern.ch\dfs\Applications\Altium\Datasheets\R0402_Phycomp_RC0402.pdf; Author: CERN DEM JLC; CreateDate: 03.12.2007; LatestRevisionDate: 17.10.2012
T4 = BSR17A: NPN Transistor; Part Description: 40V 200mA NPN General-Purpose Amplifier; Manufacturer: FAIRCHILD SEMICONDUCTOR; PressFit: No; Bonding: No; Part Number: BSR17A; Component Kind: Standard; Component Type: Standard; Device: BSR17A; PackageDescription: SOT23 3-Leads, Pitch 0.95mm - Body 1.4x3mm, IPC Medium Density; Manufacturer Part Number: BSR17A; Pin Count: 3; Case: SOT23-3; Mounted: Yes; Socket: No; SMD: Yes; Sense: No; ComponentHeight: 1.3mm; HelpURL: \\cern.ch\dfs\Applications\Altium\Datasheets\BSR17A.pdf; Author: CERN DEM JLC; CreateDate: 14.05.2008; LatestRevisionDate: 14.05.2008